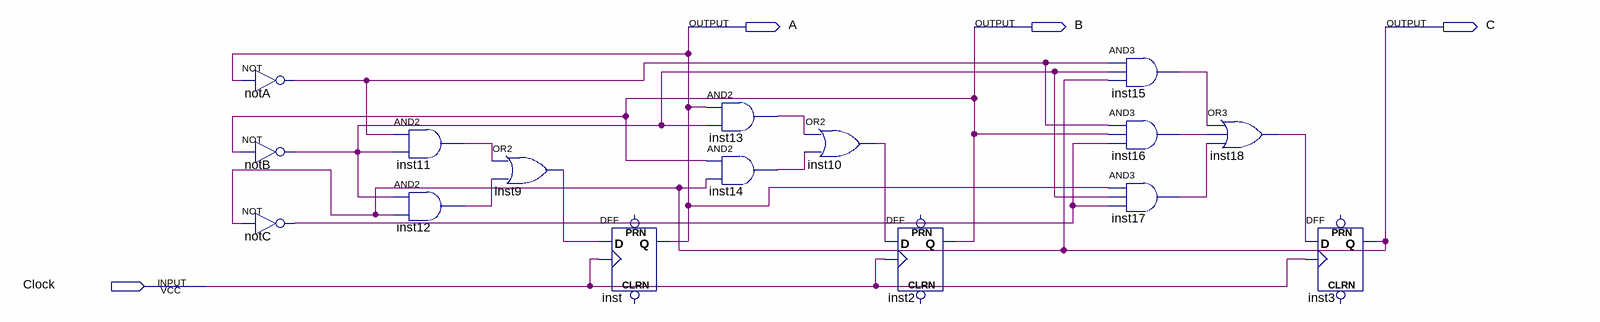
[diagram p0: schematic sheet]
// Quartus schematic proj1.bdf as structural Verilog: 16 symbols, 4 pins
module proj1 (
  input  Clock,
  output A,
  output B,
  output C
);

  wire inst9_out, inst10_out, inst11_out, inst12_out, inst13_out, inst14_out, inst15_out, inst16_out,
       inst17_out, inst18_out, notA_out, notB_out, notC_out;

  not notA (notA_out, A);
  not notB (notB_out, B);
  not notC (notC_out, C);
  and inst11 (inst11_out, notA_out, notB_out);
  and inst12 (inst12_out, notB_out, C);
  or inst9 (inst9_out, inst11_out, inst12_out);
  DFF inst (.CLK(Clock), .D(inst9_out), .Q(A));  // open: CLRN, PRN
  and inst13 (inst13_out, A, notB_out);
  and inst14 (inst14_out, B, C);
  or inst10 (inst10_out, inst13_out, inst14_out);
  DFF inst2 (.CLK(Clock), .D(inst10_out), .Q(B));  // open: CLRN, PRN
  and inst15 (inst15_out, notA_out, notB_out, C);
  and inst16 (inst16_out, notA_out, B, notC_out);
  and inst17 (inst17_out, A, notB_out, notC_out);
  or inst18 (inst18_out, inst15_out, inst16_out, inst17_out);
  DFF inst3 (.CLK(Clock), .D(inst18_out), .Q(C));  // open: CLRN, PRN
endmodule
